# Altium schematic sheet ST Link.SchDoc
size A3
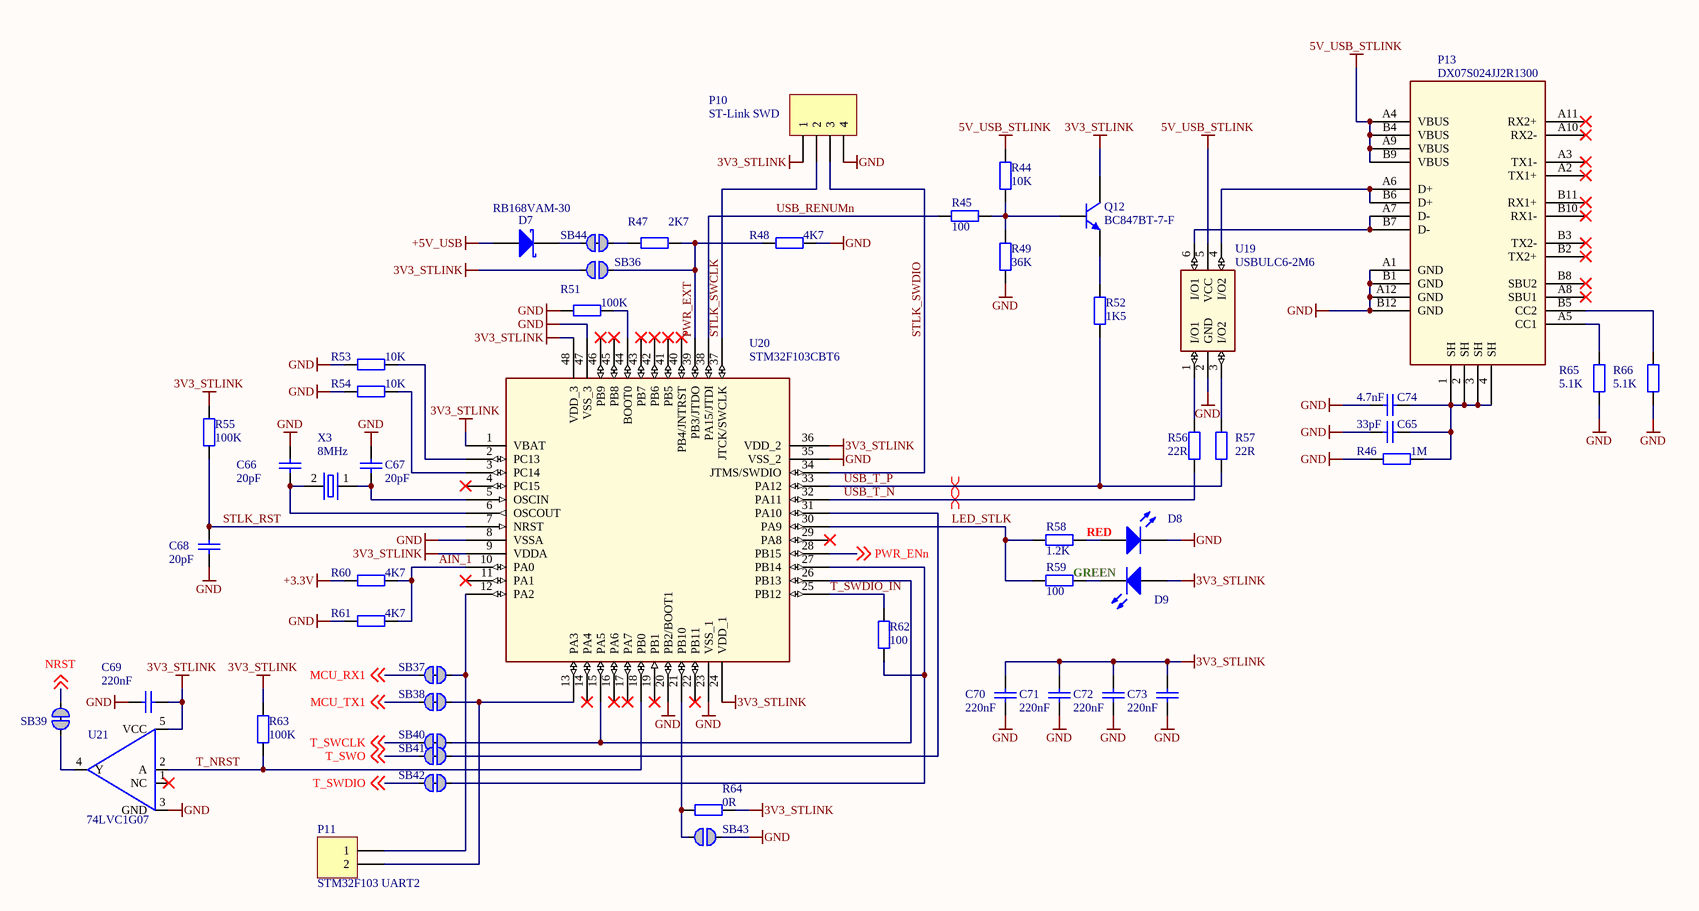
[diagram p0: ST Link.SchDoc]

## Parts
C65  value 33pF  [C0402]  (hidden comment: Cap Semi)
C66  value 20pF  [C0402]  (hidden comment: Cap Semi)
C67  value 20pF  [C0402]  (hidden comment: Cap Semi)
C68  value 20pF  [C0402]  (hidden comment: Cap Semi)
C69  value 220nF  [C0402]  (hidden comment: Cap Semi)
C70  value 220nF  [C0402]  (hidden comment: Cap Semi)
C71  value 220nF  [C0402]  (hidden comment: Cap Semi)
C72  value 220nF  [C0402]  (hidden comment: Cap Semi)
C73  value 220nF  [C0402]  (hidden comment: Cap Semi)
C74  value 4.7nF  [C0402]  (hidden comment: Cap Semi)
D7  RB168VAM-30  [SOD323]
D8  LED  [PICOLED]  (value not drawn)
D9  LED  [PICOLED]  (value not drawn)
P10  ST-Link SWD  [HDR1X4]  (no BOM)
P11  STM32F103 UART2  [HDR1X2]  (no BOM)
P13  DX07S024JJ2R1300  [DX07_USB_C]
Q12  BC847BT-7-F  [SOT-523_custom]
R44  value 10K  [R0402]  (hidden comment: Res2)
R45  value 100  [R0402]  (hidden comment: Res2)
R46  value 1M  [R0402]  (hidden comment: Res2)
R47  value 2K7  [R0402]  (hidden comment: Res2)
R48  value 4K7  [R0402]  (hidden comment: Res2)
R49  value 36K  [R0402]  (hidden comment: Res2)
R51  value 100K  [R0402]  (hidden comment: Res2)
R52  value 1K5  [R0402]  (hidden comment: Res2)
R53  value 10K  [R0402]  (hidden comment: Res2)
R54  value 10K  [R0402]  (hidden comment: Res2)  (no BOM)
R55  value 100K  [R0402]  (hidden comment: Res2)
R56  value 22R  [R0402]  (hidden comment: Res2)
R57  value 22R  [R0402]  (hidden comment: Res2)
R58  value 1.2K  [R0402]  (hidden comment: Res2)
R59  value 100  [R0402]  (hidden comment: Res2)
R60  value 4K7  [R0402]  (hidden comment: Res2)
R61  value 4K7  [R0402]  (hidden comment: Res2)
R62  value 100  [R0402]  (hidden comment: Res2)
R63  value 100K  [R0402]  (hidden comment: Res2)
R64  value 0R  [R0402]  (hidden comment: Res2)
R65  value 5.1K  [R0402]  (hidden comment: Res2)
R66  value 5.1K  [R0402]  (hidden comment: Res2)
SB36  Solderbridge  [Solderbridge]  (value not drawn)  (no BOM)
SB37  Solderbridge  [Solderbridge_Shorted]  (value not drawn)  (net tie, no BOM)
SB38  Solderbridge  [Solderbridge_Shorted]  (value not drawn)  (net tie, no BOM)
SB39  Solderbridge  [Solderbridge_Shorted]  (value not drawn)  (net tie, no BOM)
SB40  Solderbridge  [Solderbridge_Shorted]  (value not drawn)  (net tie, no BOM)
SB41  Solderbridge  [Solderbridge_Shorted]  (value not drawn)  (net tie, no BOM)
SB42  Solderbridge  [Solderbridge_Shorted]  (value not drawn)  (net tie, no BOM)
SB43  Solderbridge  [Solderbridge]  (value not drawn)  (no BOM)
SB44  Solderbridge  [Solderbridge_Shorted]  (value not drawn)  (net tie, no BOM)
U19  USBULC6-2M6  [Micro_QFN_6L]
U20  STM32F103CBT6  [QFP48 7X7]
U21  74LVC1G07  [X2-DFN1410-6]
X3  8MHz  [crystal_5032]

## Nets
3V3_STLINK: C69.2 C70.2 C71.2 C72.2 C73.2 D9.1(A) P10.1 Q12.2(C) R55.1 R63.1 R64.1 SB36.1 U20.1(VBAT) U20.9(VDDA) U20.24(VDD_1) U20.36(VDD_2) U20.48(VDD_3) U21.5(VCC)
5V_USB_STLINK: P13.A4(VBUS) P13.A9(VBUS) P13.B4(VBUS) P13.B9(VBUS) R44.2 U19.5(VCC)
+3.3V: R60.2
+5V_USB: D7.1(A)
GND: C65.1 C66.2 C67.2 C68.1 C69.1 C70.1 C71.1 C72.1 C73.1 C74.1 D8.2(K) P10.4 P13.A1(GND) P13.A12(GND) P13.B1(GND) P13.B12(GND) R46.1 R48.1 R49.1 R51.2 R53.2 R54.2 R61.2 R65.1 R66.1 SB43.2 U19.2(GND) U20.8(VSSA) U20.20(PB2/BOOT1) U20.23(VSS_1) U20.35(VSS_2) U20.47(VSS_3) U21.3(GND)
AIN_1: R60.1 R61.1 U20.10(PA0)
LED_STLK: R58.1 R59.1 U20.30(PA9)
MCU_RX1: SB37.1 ; off-sheet MCU_RX1
MCU_TX1: SB38.1 ; off-sheet MCU_TX1
NRST: SB39.2 ; off-sheet NRST
PWR_ENn: U20.28(PB15) ; off-sheet PWR_ENn
PWR_EXT: R47.1 R48.2 SB36.2 U20.39(PB3/JTDO)
STLK_RST: C68.2 R55.2 U20.7(NRST)
STLK_SWCLK: P10.2 U20.37(JTCK/SWCLK)
STLK_SWDIO: P10.3 U20.34(JTMS/SWDIO)
T_NRST: R63.2 U20.18(PB0) U21.2(A)
T_SWCLK: SB40.1 ; off-sheet T_SWCLK
T_SWDIO: SB42.1 ; off-sheet T_SWDIO
T_SWDIO_IN: R62.1 U20.25(PB12)
T_SWO: SB41.1 ; off-sheet T_SWO
USB_RENUMn: R45.2 U20.38(PA15/JTDI)
USB_T_N: R56.1 U20.32(PA11)
USB_T_P: R52.1 R57.1 U20.33(PA12)
NetC65_2: C65.2 C74.2 P13.1(SH) P13.2(SH) P13.3(SH) P13.4(SH) R46.2
NetC66_1: C66.1 U20.6(OSCOUT) X3.2
NetC67_1: C67.1 U20.5(OSCIN) X3.1
NetD7_2: D7.2(K) SB44.1
NetD8_1: D8.1(A) R58.2
NetD9_2: D9.2(K) R59.2
NetP11_1: P11.1 SB37.2 U20.12(PA2)
NetP11_2: P11.2 SB38.2 U20.13(PA3)
NetP13_A5: P13.A5(CC1) R65.2
NetP13_A6: P13.A6(D+) P13.B6(D+) U19.4(I/O2)
NetP13_A7: P13.A7(D-) P13.B7(D-) U19.6(I/O1)
NetP13_B5: P13.B5(CC2) R66.2
NetQ12_1: Q12.1(B) R44.1 R45.1 R49.2
NetQ12_3: Q12.3(E) R52.2
NetR47_2: R47.2 SB44.2
NetR51_1: R51.1 U20.44(BOOT0)
NetR53_1: R53.1 U20.2(PC13)
NetR54_1: R54.1 U20.3(PC14)
NetR56_2: R56.2 U19.1(I/O1)
NetR57_2: R57.2 U19.3(I/O2)
NetR62_2: R62.2 SB42.2 U20.27(PB14)
NetR64_2: R64.2 SB43.1 U20.21(PB10)
NetSB39_1: SB39.1 U21.4(Y)
NetSB40_2: SB40.2 U20.15(PA5) U20.26(PB13)
NetSB41_2: SB41.2 U20.31(PA10)

Not connected (* = marked no-connect by the designer): P13 A2(TX1+)* A3(TX1-)* A8(SBU1)* A10(RX2-)* A11(RX2+)* B2(TX2+)* B3(TX2-)* B8(SBU2)* B10(RX1-)* B11(RX1+)*; U20 4(PC15)* 11(PA1)* 14(PA4)* 16(PA6)* 17(PA7)* 19(PB1)* 22(PB11)* 29(PA8)* 40(PB4/JNTRST)* 41(PB5)* 42(PB6)* 43(PB7)* 45(PB8)* 46(PB9)*; U21 1(NC)*

## Layout directives
differential pair: USB_T_N, USB_T_P

## Notes on the sheet
- RED
- (near R59) GREEN

## Library data of the parts
C65-C74 = Cap Semi: Capacitor (Semiconductor SIM Model); Manufacturer: YAGEO; Manufacturer Part No.: CC0402JRNPO9BN100; Part Description: Ceramic Capacitor; Specification: NP0, 6.3V, 5%; Supplier: Rutronik; Supplier part number: KKK14556; Link: https://www.rutronik24.com/product/yageo/cc0402jrnpo9bn100/29735.html
D7 = D Schottky: Schottky Diode; Manufacturer: ROHM; Part Description: Low VF Schottky Barrier Rectifier; Specification: 30V, 1A; Manufacturer Part No.: RB168VAM-30; Supplier: Rutronik; Supplier part number: RB168VAM-30; Value: RB168VAM-30; Link: http://rohmfs.rohm.com/en/products/databook/datasheet/discrete/diode/schottky_barrier/rb168vam-30tr-e.pdf
D8 = LED2: Typical SMD LED; Manufacturer: ROHM; Manufacturer Part No.: SML-P12UTT86; Specification: Red, 20mA; Value: SML-P12UTT86; Supplier: Rutronik; Supplier part number: LED24884; Part Description: Typical SMD LED; Link: https://www.rutronik24.com/product/rohm/sml-p12utt86/8485748.html
D9 = LED2: Typical SMD LED; Manufacturer: ROHM; Manufacturer Part No.: SML-P13PTT86R; Specification: Green, 20mA; Value: SML-P13PTT86R; Supplier: Rutronik; Supplier part number: LED26047; Part Description: Typical SMD LED; Link: https://www.rutronik24.com/product/rohm/sml-p13ptt86r/11064312.html
P10 = Header 4: Header, 4-Pin
P11 = Header 2: Header, 2-Pin
P13 = DX07S024JJ2R1300: 24P USB C DUAL SMT ON BOARD; Manufacturer: JAE; Specification: Type C; Link: https://www.rutronik24.com/product/jae/dx07s024jj2r1300/8301548.html; Manufacturer Part No.: DX07S024JJ2R1300; Part Description: 24P USB C DUAL SMT ON BOARD; Supplier: Rutronik; Supplier part number: CONIO1808; Value: DX07S024JJ2R1300
Q12 = NPN: NPN Bipolar Transistor; Manufacturer: Diodes Inc.; Manufacturer Part No.: BC847AT-7-F; Part Description: 45V NPN SMALL SIGNAL TRANSISTOR; Specification: 45V, 0.1A; Value: BC847AT-7-F; Link: https://www.rutronik24.com/product/diodes+inc/bc847at-7-f/11676160.html; Supplier: Rutronik; Supplier part number: BC847AT-7-F
R44 R45 R47-R49 R51-R66 = Res2: Manufacturer: ASJ; Manufacturer Part No.: CR10-103-JK; Part Description: Thick Film Resistor; Specification: 5% 0,063W; Supplier: Rutronik; Supplier part number: WRC40976; Link: https://www.rutronik24.com/product/asj/cr10-103-jk/54295.html
R46 = Res2: Manufacturer: YAGEO; Manufacturer Part No.: RC0402FR-070RL; Part Description: Thick Film Resistor; Specification: 5% 0,063W; Supplier: Rutronik; Supplier part number: WRC53079; Link: https://www.rutronik24.com/product/yageo/rc0402fr-070rl/5183530.html
SB37-SB42 SB44 = Solderbridge Shorted: Manufacturer: *; Value: Solderbridge; Supplier: *; Supplier part number: *
U19 = USBULC6-2M6: Ultra large bandwidth ESD protection; Manufacturer: STMicroelectronics; Specification: 6V, 0.6pF; Link: https://www.rutronik24.com/product/st/usbulc6-2m6/3623499.html; Manufacturer Part No.: USBULC6-2M6; Part Description: Ultra large bandwidth ESD protection; Supplier: Rutronik; Supplier part number: DTRL11259; Value: USBULC6-2M6
U20 = STM32F103CBT6: Medium-density performance line ARM-based 32-bit MCU with 64KB Flash; Manufacturer: STMicroelectronics; Part Description: ARM® Cortex®-M3 STM32F1 Microcontroller IC 32-Bit 72MHz 128KB (128K x 8) FLASH; Specification: 128KB Flash, 20KB RAM; Link: https://www.rutronik24.com/product/st/stm32f103cbt6/18975.html; Manufacturer Part No.: STM32F103CBT6; Supplier: Rutronik; Supplier part number: ICMCU17424; Value: STM32F103CBT6
U21 = 74LVC1G07: SINGLE BUFFER/DRIVER WITH OPEN DRAIN OUTPUT; Manufacturer: STMicroelectronics; Manufacturer Part No.: 74LVC1G07FZ4-7; Specification: 5.5V, 1.65V; Value: 74LVC1G07FZ4-7; Link: https://www.rutronik24.com/product/diodes+inc/74lvc1g07fz4-7/11672158.html; Part Description: SINGLE BUFFER/DRIVER WITH OPEN DRAIN OUTPUT; Supplier: Rutronik; Supplier part number: 74LVC1G07FZ4-7
X3 = XTL-000011-01: Manufacturer: Kyocera; Manufacturer Part No.: CX5032GB08000H0HEQZ1; Part Description: XTAL 5.0x3.2mmm; Specification: 8MHz, 12pF, 20ppm; Value: CX5032GB08000H0HEQZ1; Supplier: Rutronik; Supplier part number: CX5032GB08000H0HEQZ1; Link: https://global.kyocera.com/prdct/electro/product/crystal-device/xtal/
SB36 SB43 = Solderbridge: Manufacturer: *; Value: Solderbridge; Supplier: *; Supplier part number: *